# EasyEDA Pro project ProPrj_背包小智mini-c3_2025-12-10.epro

# Schematic Schematic1
Board Name: Board1; Create Date: 2025-05-15; Page Name: P1; Project Name: 复刻虾哥团队xmini c3; Schematic Name: Schematic1; Update Date: 2025-05-15; Company: 嘉立创EDA; Page Size: A4; Version: V1.0
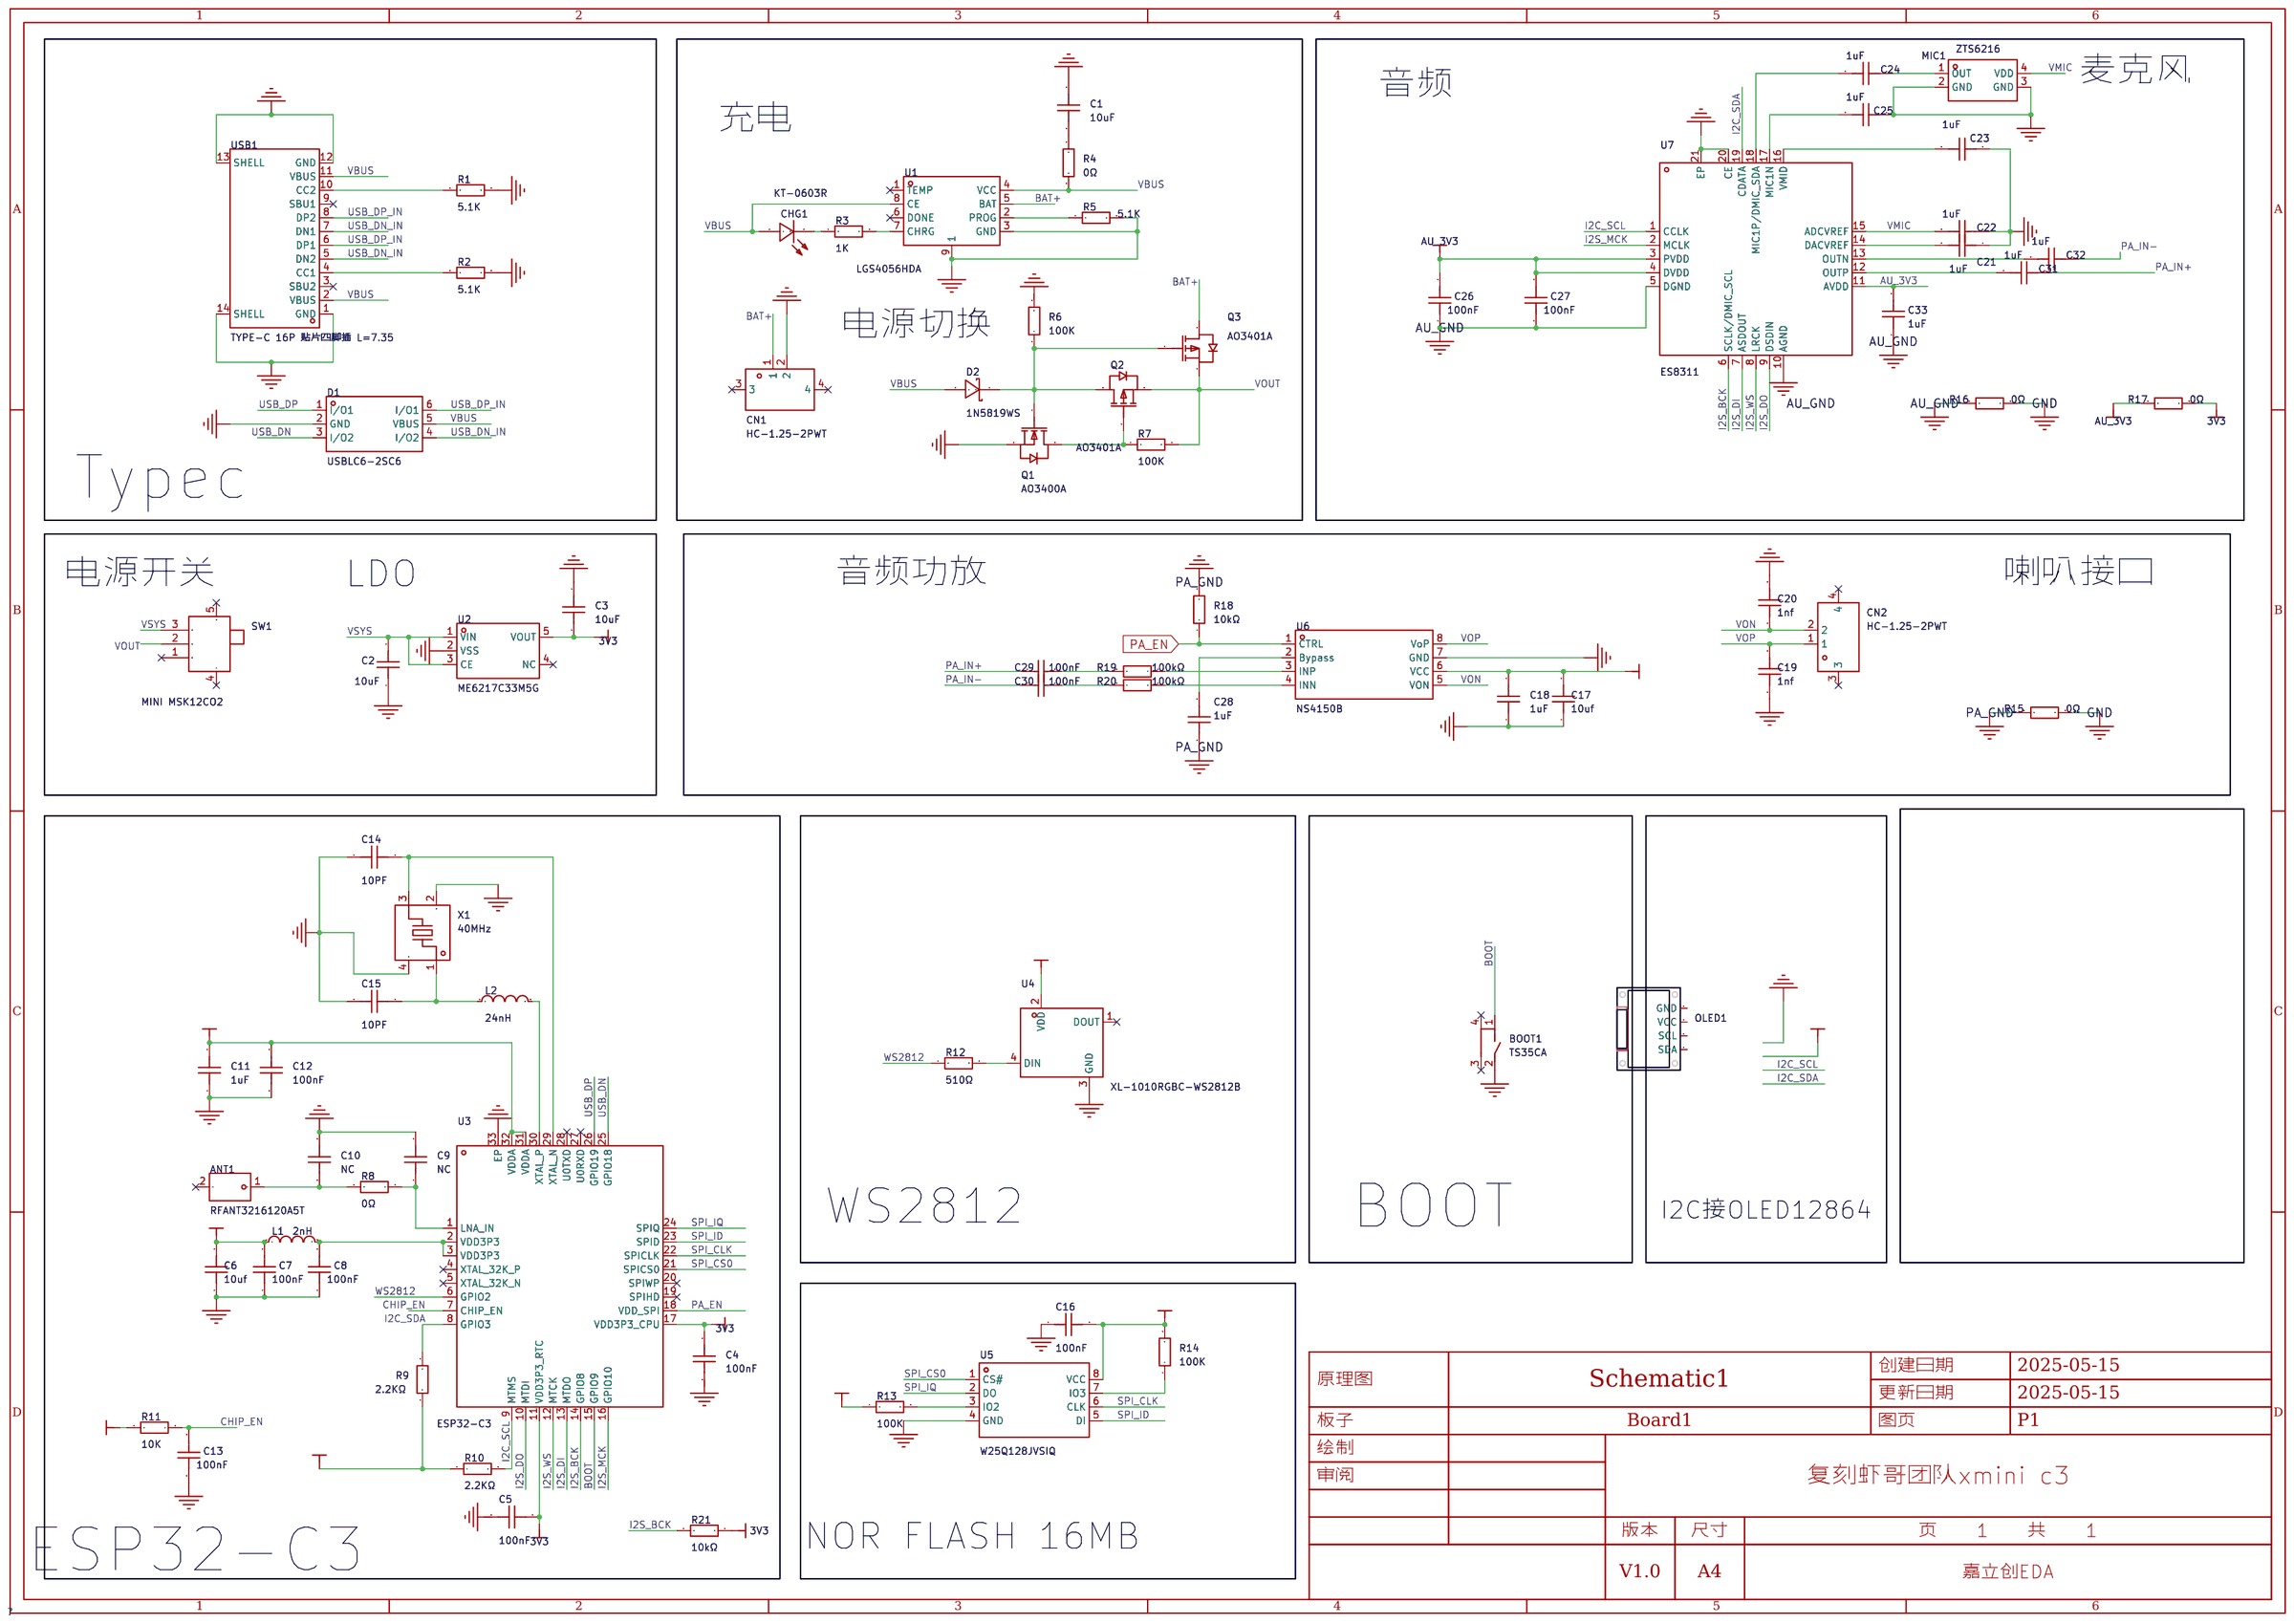
[diagram p0: schematic sheet]

## Parts
ANT1  RFANT3216120A5T  [FILTER-SMD_1206-2P-L3.2-W1.6-L]
BOOT1  TS35CA  [KEY-SMD_TS35CA]
C1  10uF  [C0402]
C2  10uF  [C0402]
C3  10uF  [C0402]
C4  100nF  [C0402]
C5  100nF  [C0402]
C6  10uf  [C0402]
C7  100nF  [C0402]
C8  100nF  [C0402]
C9  NC  [C0402]
C10  NC  [C0402]
C11  1uF  [C0402]
C12  100nF  [C0402]
C13  100nF  [C0402]
C14  10PF  [C0402]
C15  10PF  [C0402]
C16  100nF  [C0402]
C17  10uf  [C0402]
C18  1uF  [C0402]
C19  1nf  [C0402]
C20  1nf  [C0402]
C21  1uF  [C0402]
C22  1uF  [C0402]
C23  1uF  [C0402]
C24  1uF  [C0402]
C25  1uF  [C0402]
C26  100nF  [C0402]
C27  100nF  [C0402]
C28  1uF  [C0402]
C29  100nF  [C0402]
C30  100nF  [C0402]
C31  1uF  [C0402]
C32  1uF  [C0402]
C33  1uF  [C0402]
CHG1  KT-0603R  [LED0603-RD]
CN1  HC-1.25-2PWT  [CONN-SMD_2P-P1.25-HC-1.25-2PWT]
CN2  HC-1.25-2PWT  [CONN-SMD_2P-P1.25-HC-1.25-2PWT]
D1  USBLC6-2SC6  [SOT-23-6_L2.9-W1.6-P0.95-LS2.8-BL]
D2  1N5819WS  [SOD-323_L1.8-W1.3-LS2.5-RD]
L1  2nH  [L0402]
L2  24nH  [L0402]
MIC1  ZTS6216  [MIC-SMD_4P-L2.8-W1.9-P1.84-TL]
OLED1  -  [0.96OLED_4P]
Q1  AO3400A  [SOT-23-3_L2.9-W1.3-P1.90-LS2.4-BR]
Q2  AO3401A  [SOT-23_L2.9-W1.3-P1.90-LS2.4-BR]
Q3  AO3401A  [SOT-23_L2.9-W1.3-P1.90-LS2.4-BR]
R1  5.1K  [R0402]
R2  5.1K  [R0402]
R3  1K  [R0402]
R4  0Ω  [R0402]
R5  5.1K  [R0402]
R6  100K  [R0402]
R7  100K  [R0402]
R8  0Ω  [R0402]
R9  2.2KΩ  [R0402]
R10  2.2KΩ  [R0402]
R11  10K  [R0402]
R12  510Ω  [R0402]
R13  100K  [R0402]
R14  100K  [R0402]
R15  0Ω  [R0402]
R16  0Ω  [R0402]
R17  0Ω  [R0402]
R18  10kΩ  [R0402]
R19  100kΩ  [R0402]
R20  100kΩ  [R0402]
R21  10kΩ  [R0402]
SW1  MINI MSK12CO2  [SW-SMD_MSK12CO2]
U1  LGS4056HDA  [DFN-8_L2.0-W2.0-P0.50-TL-EP1.6]
U2  ME6217C33M5G  [SOT-23-5_L3.0-W1.7-P0.95-LS2.8-BR]
U3  ESP32-C3  [QFN-32_L5.0-W5.0-P0.50-TL-EP3.7]
U4  XL-1010RGBC-WS2812B  [LED-SMD_4P-L1.0-W1.0-TL_XL-1010RGBC-WS2812B]
U5  W25Q128JVSIQ  [SOIC-8_L5.3-W5.3-P1.27-LS8.0-BL]
U6  NS4150B  [MSOP-8_L3.0-W3.0-P0.65-LS5.0-BL]
U7  ES8311  [WQFN-20_L3.0-W3.0-P0.40-BL-EP1.7]
USB1  TYPE-C 16P 贴片四脚插 L=7.35  [USB-C-SMD_TYPE-C-6PIN-2MD-073]
X1  40MHz  [CRYSTAL-SMD_4P-L2.5-W2.0-BL]

## Library data of the parts
ANT1 = RFANT3216120A5T: 天线类型:芯片天线;中心频点:2.4GHz;带宽:-;峰值增益:2dBi;极化方式:-;功率容量:-;驻波比:2;; LCSC Part Name: 2.4GHz ISM频段工作频率的多层陶瓷天线; Supplier Part: C127629; Manufacturer: Walsin(华新科); Supplier Footprint: 1206; JLCPCB Part Class: 扩展库; Datasheet: https://atta.szlcsc.com/upload/public/pdf/source/20180326/C127629_E7A81F7A36316F7BB6F0FA74BB27F225.pdf; Supplier: LCSC; Antenna Type: 芯片天线; Central Frequency: 2.4GHz; Peak Gain: 2dBi; VSWR: 2; Operating Temperature: -40℃~+85℃
BOOT1 = TS35CA: 电路结构:单刀单掷;按钮形状:圆形按钮;作用力:250gf;安装方式:卧贴;开关长度:4.45mm;开关宽度:3.4mm;开关高度:3.3mm;带支架:-;触点电流:50mA;额定电压(AC):-;额定电压(DC):12V;额定功率:-;绝缘电阻:-;带灯:-;机械寿命:-;; LCSC Part Name: 4.45*3.4*3.3mm 卧贴 轻触开关; Supplier Part: C412366; Manufacturer: SHOU HAN(首韩); Supplier Footprint: SMD,3.3x4.5mm; JLCPCB Part Class: 扩展库; Datasheet: https://atta.szlcsc.com/upload/public/pdf/source/20230710/1655F8A2086A8DCFA96887FF46DC3B55.pdf; Supplier: LCSC; Circuit: 单刀单掷; Actuator Style: 圆形按钮; Operating Force: 250gf; Mounting Style: 卧贴; Switch Length: 4.45mm; Switch Width: 3.4mm; Switch Height: 3.3mm; Contact Current: 50mA; Voltage Rating (DC): 12V
C1-C27 C31 C32 = CAP_0402: Supplier Footprint: 0402
C28 C33 = CL05A105KA5NQNC: 容值:1uF;精度:±10%;额定电压:25V;材质(温度系数):X5R;; LCSC Part Name: 1uF ±10% 25V; Supplier Part: C52923; Manufacturer: SAMSUNG(三星); Supplier Footprint: 0402; Datasheet: https://atta.szlcsc.com/upload/public/pdf/source/20160103/1457707735223.pdf; Supplier: LCSC; Tolerance: ±10%; Voltage Rated: 25V; Temperature Coefficient: X5R; Check: true
C29 C30 = CL05B104KO5NNNC: 容值:100nF;精度:±10%;额定电压:16V;材质(温度系数):X7R;; LCSC Part Name: 100nF ±10% 16V; Supplier Part: C1525; Manufacturer: SAMSUNG(三星); Supplier Footprint: 0402; Datasheet: https://atta.szlcsc.com/upload/public/pdf/source/20160218/1457707763339.pdf; Supplier: LCSC; Tolerance: ±10%; Voltage Rated: 16V; Temperature Coefficient: X7R; Check: true
CHG1 = KT-0603R: 发光颜色:红色;功率:-;正向电流:-;主波长:-;二极管配置:-;透镜颜色:-;色温:-;发光角度:-;载带方式:-;工作温度:-40℃~+85℃;; LCSC Part Name: 0603 红灯 高亮; Supplier Part: C2286; Manufacturer: KENTO; Supplier Footprint: 0603; JLCPCB Part Class: 基础库; Datasheet: https://atta.szlcsc.com/upload/public/pdf/source/20160616/1466072038404.pdf; Supplier: LCSC; Emitted Color: 红色; Operating Temperature: -40℃~+85℃
CN1 CN2 = HC-1.25-2PWT: 插针结构:1x2P;间距:1.25mm;安装方式:卧贴;参考系列:PicoBlade(MX 1.25);总PIN数:2P;排数:1;每排PIN数:2;行距:-;额定电流:1A;触头材质:黄铜;触头镀层:锡;工作温度范围:-40℃~+105℃;; LCSC Part Name: 1x2P 间距:1.25mm 卧贴 系列:PicoBlade(MX 1.25); Supplier Part: C2845379; Manufacturer: HCTL(华灿天禄); Supplier Footprint: SMD,P=1.25mm,卧贴; JLCPCB Part Class: 扩展库; Datasheet: https://atta.szlcsc.com/upload/public/pdf/source/20240930/9508A8292CCC87B0C29E3A028D56E30A.pdf; Supplier: LCSC; Pins Structure: 1x2P; Pitch: 1.25mm; Mounting Style: 卧贴; Reference Series: PicoBlade(MX 1.25); Number of Pins: 2P; Number of Rows: 1; Number of PINs Per Row: 2; Current Rating (Max): 1A; Contact Material: 黄铜; Contact Plating: 锡; Operating Temperature Range: -40℃~+105℃; Rated Voltage (Max): 125V; Plastic Material: LCP; Flame Retardant Rating: UL94V-0; Supplementary Features: 辅助焊脚; Z-Height of the Board: 3.57mm; X-Length of Bottom Edge on Board (Spacing Line): 7.55mm; Y-Width of Bottom Edge on Board: 5.25mm
D1 = USBLC6-2SC6: 最大钳位电压:15V;击穿电压:6V;; Supplier Part: C2687116; Manufacturer: UMW(友台半导体); Supplier Footprint: SOT-23-6; JLCPCB Part Class: 扩展库; Datasheet: https://atta.szlcsc.com/upload/public/pdf/source/20231109/512642D850D9873E7C519F71E85B9A10.pdf; Supplier: LCSC; Maximum Clamping Voltage: 15V; Breakdown Voltage: 6V; Number of Lines: 双路; Type: ESD
D2 = 1N5819WS_C191023: 正向压降(Vf):600mV@1A;直流反向耐压(Vr):40V;整流电流:1A;; LCSC Part Name: 电压:40V 电流:1A; Supplier Part: C191023; Manufacturer: Hottech(合科泰); Supplier Footprint: SOD-323; JLCPCB Part Class: 基础库; Datasheet: https://atta.szlcsc.com/upload/public/pdf/source/20220428/3CB86FD8D28D653594B4E35F9D5AEFD9.pdf; Supplier: LCSC; Forward Voltage (Vf@If): 600mV@1A; Reverse Voltage (Vr): 40V; Rectified Current: 1A
L1 L2 = L_0402
MIC1 = ZTS6216: 方向:全指向;信噪比:65dB;灵敏度:-38dB;阻抗:100Ω;; Supplier Part: C481302; Manufacturer: ZILLTEK(钰太); Supplier Footprint: SMD-4P,1.9x2.8mm; JLCPCB Part Class: Extended Part; Datasheet: https://atta.szlcsc.com/upload/public/pdf/source/20200316/C481302_3CBECE2A7DED4DFD53CEA082844189F4.pdf; Supplier: LCSC; Direction: 全指向; Sensitivity: -38dB; SNR(Signal to Noise Ratio): 65dB; Current Consumption: 120uA; Supply Voltage: 1.5V~3.6V; Impedance: 100Ω
OLED1 = 0.96OLED模块_4P: Supplier Footprint: 插件
Q1 = AO3400A_C20917: 类型:1个N沟道;漏源电压(Vdss):30V;连续漏极电流(Id):5.7A;导通电阻(RDS(on)@Vgs,Id):26.5mΩ@10V,5.7A;功率(Pd):1.4W;阈值电压(Vgs(th)@Id):1.5V@250uA;; LCSC Part Name: 1个N沟道 耐压:30V 电流:5.7A; Supplier Part: C20917; Manufacturer: AOS; Supplier Footprint: SOT-23-3L; JLCPCB Part Class: 基础库; Datasheet: https://atta.szlcsc.com/upload/public/pdf/source/20140107/1457706668533.pdf; Supplier: LCSC; Type: 1个N沟道; Drain Source Voltage (Vdss): 30V; Continuous Drain Current (Id): 5.7A; Drain Source On Resistance (RDS(on)@Vgs,Id): 26.5mΩ@10V,5.7A; Power Dissipation (Pd): 1.4W; Gate Threshold Voltage (Vgs(th)@Id): 1.5V@250uA; Total Gate Charge (Qg@Vgs): 7nC@4.5V; Input Capacitance (Ciss@Vds): 630pF@15V; Operating Temperature: -55℃~+150℃@(Tj)
Q2 Q3 = AO3401A_C15127: 类型:1个P沟道;漏源电压(Vdss):30V;连续漏极电流(Id):4A;导通电阻(RDS(on)@Vgs,Id):44mΩ@10V,4.3A;功率(Pd):1.4W;阈值电压(Vgs(th)@Id):1.3V@250uA;; LCSC Part Name: 1个P沟道 耐压:30V 电流:4A; Supplier Part: C15127; Manufacturer: AOS; Supplier Footprint: SOT-23; JLCPCB Part Class: 基础库; Datasheet: https://atta.szlcsc.com/upload/public/pdf/source/20160507/1462613609053.pdf; Supplier: LCSC; Type: 1个P沟道; Drain Source Voltage (Vdss): 30V; Continuous Drain Current (Id): 4A; Drain Source On Resistance (RDS(on)@Vgs,Id): 44mΩ@10V,4.3A; Power Dissipation (Pd): 1.4W; Gate Threshold Voltage (Vgs(th)@Id): 1.3V@250uA; Total Gate Charge (Qg@Vgs): 12.2nC@4.5V; Input Capacitance (Ciss@Vds): 1.2nF@15V; Operating Temperature: -55℃~+150℃@(Tj)
R1-R14 = Res_0402: Supplier Footprint: 0402
R15-R17 = 0402WGF0000TCE: 电阻类型:厚膜电阻;阻值:0Ω;精度:±1%;功率:62.5mW;; LCSC Part Name: 0Ω ±1% 62.5mW; Supplier Part: C17168; Manufacturer: UNI-ROYAL(厚声); Supplier Footprint: 0402; Datasheet: https://atta.szlcsc.com/upload/public/pdf/source/20200306/C422600_1E6D84923E4A46A82E41ADD87F860B5C.pdf; Supplier: LCSC; Type: 厚膜电阻; Tolerance: ±1%; Power(Watts): 62.5mW; Temperature Coefficient: ±800ppm/℃; Overload Voltage (Max): 50V; Operating Temperature Range: -55℃~+155℃; Check: true
R18 R21 = 0402WGF1002TCE: 电阻类型:厚膜电阻;阻值:10kΩ;精度:±1%;功率:62.5mW;温度系数:±100ppm/℃;; LCSC Part Name: 厚膜电阻 10kΩ ±1% 62.5mW; Supplier Part: C25744; Manufacturer: UNI-ROYAL(厚声); Supplier Footprint: 0402; Datasheet: https://atta.szlcsc.com/upload/public/pdf/source/20200306/C422600_1E6D84923E4A46A82E41ADD87F860B5C.pdf; Supplier: LCSC; Type: 厚膜电阻; Tolerance: ±1%; Power(Watts): 62.5mW; Temperature Coefficient: ±100ppm/℃; Overload Voltage (Max): 50V; Operating Temperature Range: -55℃~+155℃; Check: true
R19 R20 = 0402WGF1003TCE: 电阻类型:厚膜电阻;阻值:100kΩ;精度:±1%;功率:62.5mW;; LCSC Part Name: 100kΩ ±1% 62.5mW; Supplier Part: C25741; Manufacturer: UNI-ROYAL(厚声); Supplier Footprint: 0402; JLCPCB Part Class: 基础库; Datasheet: https://atta.szlcsc.com/upload/public/pdf/source/20200306/C422600_1E6D84923E4A46A82E41ADD87F860B5C.pdf; Supplier: LCSC; Type: 厚膜电阻; Tolerance: ±1%; Power(Watts): 62.5mW; Temperature Coefficient: ±100ppm/℃; Overload Voltage (Max): 50V; Operating Temperature Range: -55℃~+155℃; Check: true
SW1 = MINI MSK12CO2: 电路结构:单刀双掷;安装方式:卧贴;开关颜色:-;额定电流(DC):50mA;额定电压(DC):12V;额定电流(AC):-;额定电压(AC):-;机械寿命:1万次;; LCSC Part Name: 迷你七脚两档侧拨拨动 mini七7脚 微型拨动; Supplier Part: C2681570; Manufacturer: SHOU HAN(首韩); Supplier Footprint: SMD; JLCPCB Part Class: 扩展库; Datasheet: https://atta.szlcsc.com/upload/public/pdf/source/20210224/C2681570_D263F9C605E4588A4AE6114B72AE4C72.pdf; Supplier: LCSC; Circuit: 单刀双掷; Pin Style: SMD接片; Switch Length: 5mm; Switch Width: 2.75mm; Switch Height: 1.4mm; Mounting Style: 卧贴; Current Rating (DC): 50mA; Voltage Rating (DC): 12V; Mechanical Life: 1万次; Operating Temperature: -16℃~+60℃
U1 = LGS4056HDA: 工作电压:4V~6V;最大充电电流:1A;电池类型:锂离子/聚合物;电池节数:1;; LCSC Part Name: TP4056H(DFN); Supplier Part: C5124109; Manufacturer: Legend-Si(棱晶半导体); Supplier Footprint: DFN-8(2x2); JLCPCB Part Class: 扩展库; Datasheet: https://atta.szlcsc.com/upload/public/pdf/source/20230407/EF281A5928E4D64337F5505487E44644.pdf; Supplier: LCSC; The Chip Type: 线性充电芯片; Supply Voltage: 4V~6V; Maximum Charge Current: 1A; Charging Saturation Voltage: 4.2V; Type of Battery: 锂离子/聚合物; Number of Cells: 1; Operating Temperature: -40℃~+125℃
U2 = ME6217C33M5G: 输出类型:固定;最大输入电压:7V;输出电压:3.3V;最大输出电流:800mA;电源纹波抑制比(PSRR):65dB@(1kHz);输出极性:正极;; LCSC Part Name: 输入7V 输出3.3V 800mA; Supplier Part: C427602; Manufacturer: MICRONE(南京微盟); Supplier Footprint: SOT-23-5; JLCPCB Part Class: 扩展库; Datasheet: https://atta.szlcsc.com/upload/public/pdf/source/20190910/C427602_D4B9162A2E9D9EF57C60010DFDECEF37.pdf; Supplier: LCSC; Output Type: 固定; Maximum Input Voltage: 7V; Output Voltage: 3.3V; MAX Output Current: 800mA; Power Supply Rejection Ratio (PSRR): 65dB@(1kHz); Dropout Voltage: 180mV@(300mA); Output Polarity: 正极; Number of Outputs: 1
U3 = ESP32-C3: CPU内核:RISC-V;CPU最大主频:160MHz;应用领域:-;; Supplier Part: C2838500; Manufacturer: ESPRESSIF(乐鑫); Supplier Footprint: QFN-32-EP(5x5); JLCPCB Part Class: 扩展库; Datasheet: https://atta.szlcsc.com/upload/public/pdf/source/20231220/86199E4714F7A99F6AA9401EA48CDBDA.pdf; Supplier: LCSC; CPU Core: RISC-V; CPU Maximum Speed: 160MHz; GPIO Ports Number: 22; ADC (Bit): 12bit; Low Voltage Detection Threshold: 3V~3.6V
U4 = XL-1010RGBC-WS2812B: 0404幻彩/1010幻彩 ws2812B 内置驱动IC 小尺寸幻彩; Supplier Part: C5349953; Manufacturer: XINGLIGHT(成兴光); Supplier Footprint: SMD,1x1mm; JLCPCB Part Class: 扩展库; Datasheet: https://atta.szlcsc.com/upload/public/pdf/source/20240218/17D2BD8F4295D202E0F5662BF6E5539A.pdf; Supplier: LCSC
U5 = W25Q128JVSIQ: 接口类型:SPI;存储容量:128Mbit;时钟频率(fc):133MHz;; LCSC Part Name: W25Q128JVSIQ 编带; Supplier Part: C97521; Manufacturer: WINBOND(华邦); Supplier Footprint: SOIC-8-208mil; JLCPCB Part Class: 基础库; Datasheet: https://atta.szlcsc.com/upload/public/pdf/source/20170316/1489627409956.pdf; Supplier: LCSC; Interface Type: SPI; Memory Size: 128Mbit; Clock Frequency (fc): 133MHz; Supply Voltage: 2.7V~3.6V; Page Programming Time (Tpp): 700us; Block Erase Time (tBE): 120ms@(32KB); Data Retention - TDR (Year): 20年; Operating Temperature: -40℃~+85℃
U6 = NS4150B_C189961: 功放类型:D类功放;输出功率:3Wx1@4Ω;; Supplier Part: C189961; Manufacturer: Nsiway(纳芯威); Supplier Footprint: MSOP-8; JLCPCB Part Class: 扩展库; Datasheet: https://atta.szlcsc.com/upload/public/pdf/source/20220916/DAE631F3909B9CBB38BDE76E3E6D5896.pdf; Supplier: LCSC; Type of Power Amplifier: D类功放; Output Power: 3Wx1@4Ω; Supply Voltage: 3V~5.25V
U7 = ES8311: Supplier Part: C962342; Manufacturer: Everest-semi(顺芯); Supplier Footprint: WQFN-20-EP(3x3); JLCPCB Part Class: 扩展库; Datasheet: https://atta.szlcsc.com/upload/public/pdf/source/20210630/C962342_E665EAE7274179BC7C5A390EC8AC685C.pdf; Supplier: LCSC; Check: true
USB1 = TYPE-C 16P 贴片四脚插 L=7.35: Supplier Part: C9900004817; Supplier Footprint: type-c 16PIN; JLCPCB Part Class: 扩展库; Supplier: LCSC
X1 = X252040MMB4SI: 晶振类型:贴片晶振;频率:40MHz;常温频差:±10ppm;外接负载电容:10pF;频率稳定度(全温):±20ppm;; LCSC Part Name: 40MHz ±10ppm 10pF; Supplier Part: C2885592; Manufacturer: YXC(扬兴晶振); Supplier Footprint: SMD2520-4P; JLCPCB Part Class: 扩展库; Datasheet: https://atta.szlcsc.com/upload/public/pdf/source/20240329/8B53C0AFBC5BB264DFB5D72B3757797A.pdf; Supplier: LCSC; Crystal Type: 贴片晶振; Normal temperature Frequency Tolerance: ±10ppm; External load capacitor: 10pF; Frequency Stability(Full temperature range): ±20ppm; Operating Temperature: -40℃~+85℃

## Nets
3V3: C3.2 C4.1 C5.1 C6.2 C7.2 C11.2 C12.1 C16.2 L1.1 R9.1 R10.1 R11.1 R13.1 R14.2 R17.2 R21.1 U2.5(VOUT) U3.11(VDD3P3_RTC) U3.17(VDD3P3_CPU) U3.31(VDDA) U3.32(VDDA) U5.8(VCC)
GND: BOOT1.2 C1.2 C2.1 C3.1 C4.2 C5.2 C6.1 C7.1 C8.1 C9.2 C10.2 C11.1 C12.2 C13.1 C14.1 C15.1 C16.1 CN1.2 D1.2(GND) Q1.2(S) R1.2 R2.2 R5.2 R6.2 R15.2 R16.2 U1.3(GND) U1.9(1) U2.2(VSS) U3.33(EP) U4.3(GND) U5.4(GND) USB1.1(GND) USB1.12(GND) USB1.13(SHELL) USB1.14(SHELL) X1.2(GND) X1.4(GND)
VBUS: CHG1.2(A) D1.5(VBUS) D2.2(A) R4.1 U1.4(VCC) U1.8(CE) USB1.2(VBUS) USB1.11(VBUS)
AU_3V3: C26.2 C27.2 C33.2 R17.1 U7.3(PVDD) U7.4(DVDD) U7.11(AVDD)
AU_GND: C21.1 C22.1 C23.1 C25.1 C26.1 C27.1 C33.1 MIC1.2(GND) MIC1.3(GND) R16.1 U7.5(DGND) U7.10(AGND) U7.20(CE) U7.21(EP)
BAT+: CN1.1 Q3.3(D) U1.5(BAT)
BOOT: BOOT1.1 U3.15(GPIO9)
CHIP_EN: C13.2 R11.2 U3.7(CHIP_EN)
I2C_SCL: R10.2 U3.9(MTMS) U7.1(CCLK)
I2C_SDA: R9.2 U3.8(GPIO3) U7.19(CDATA)
I2S_BCK: R21.2 U3.14(GPIO8) U7.6(SCLK/DMIC_SCL)
I2S_DI: U3.13(MTDO) U7.7(ASDOUT)
I2S_DO: U3.10(MTDI) U7.9(DSDIN)
I2S_MCK: U3.16(GPIO10) U7.2(MCLK)
I2S_WS: U3.12(MTCK) U7.8(LRCK)
PA-GND: C19.1
PA_EN: R18.1 U3.18(VDD_SPI) U6.1(CTRL)
PA_GND: C17.1 C18.1 C20.2 C28.1 R15.1 R18.2 U6.7(GND)
PA_IN+: C29.1 C31.1
PA_IN-: C30.1 C32.1
SPI_CLK: U3.22(SPICLK) U5.6(CLK)
SPI_CS0: U3.21(SPICS0) U5.1(CS#)
SPI_ID: U3.23(SPID) U5.5(DI)
SPI_IQ: U3.24(SPIQ) U5.2(DO)
USB_DN: D1.3(I/O2) U3.25(GPIO18)
USB_DN_IN: D1.4(I/O2) USB1.5(DN2) USB1.7(DN1)
USB_DP: D1.1(I/O1) U3.26(GPIO19)
USB_DP_IN: D1.6(I/O1) USB1.6(DP1) USB1.8(DP2)
VMIC: C22.2 MIC1.4(VDD) U7.15(ADCVREF)
VON: C20.1 CN2.2 U6.5(VON)
VOP: C19.2 CN2.1 U6.8(VoP)
VOUT: Q2.2(S) Q3.2(S) R7.2 SW1.2
VSYS: C2.2 C17.2 C18.2 SW1.3 U2.1(VIN) U2.3(CE) U4.2(VDD) U6.6(VCC)
WS2812: R12.1 U3.6(GPIO2)
$1N230: R1.1 USB1.10(CC2)
$1N256: R2.1 USB1.4(CC1)
$1N1694: R3.2 U1.7(CHRG)
$1N1831: C1.1 R4.2
$1N1925: CHG1.1(K) R3.1
$1N2033: R5.1 U1.2(PROG)
$1N2547: D2.1(K) Q1.1(G) Q2.3(D) Q3.1(G) R6.1
$1N2764: Q1.3(D) Q2.1(G) R7.1
$1N4486: C8.2 L1.2 U3.2(VDD3P3) U3.3(VDD3P3)
$1N4620: C9.1 R8.2 U3.1(LNA_IN)
$1N4624: ANT1.1 C10.1 R8.1
$1N6468: L2.2 U3.30(XTAL_P)
$1N6474: C15.2 L2.1 X1.1
$1N6490: C14.2 U3.29(XTAL_N) X1.3
$1N6785: R12.2 U4.4(DIN)
$1N7034: R13.2 U5.3(IO2)
$1N7137: R14.1 U5.7(IO3)
$1N8680: C21.2 U7.14(DACVREF)
$1N8771: C23.2 U7.16(VMID)
$1N8899: C24.2 U7.18(MIC1P/DMIC_SDA)
$1N8902: C24.1 MIC1.1(OUT)
$1N8930: C25.2 U7.17(MIC1N)
$1N9545: R19.1 U6.3(INP)
$1N9546: R20.1 U6.4(INN)
$1N9548: C28.2 U6.2(Bypass)
$1N9551: C29.2 R19.2
$1N9552: C30.2 R20.2
$1N11611: C31.2 U7.12(OUTP)
$1N11651: C32.2 U7.13(OUTN)

Not connected (* = marked no-connect by the designer): ANT1 2*; BOOT1 3* 4*; CN1 3* 4*; CN2 3* 4*; OLED1 1(GND) 2(VCC) 3(SCL) 4(SDA); SW1 1* 4* 5*; U1 1(TEMP)* 6(DONE)*; U2 4(NC)*; U3 4(XTAL_32K_P)* 5(XTAL_32K_N)* 19(SPIHD)* 20(SPIWP)* 27(U0RXD)* 28(U0TXD)*; U4 1(DOUT)*; USB1 3(SBU2)* 9(SBU1)*

## Notes on the sheet
- 麦克风
- 音频
- 充电
- 电源切换
- Typec
- 电源开关
- LDO
- 音频功放
- 喇叭接口
- WS2812
- BOOT
- I2C接OLED12864
- NOR FLASH 16MB
- ESP32-C3

# Board PCB1
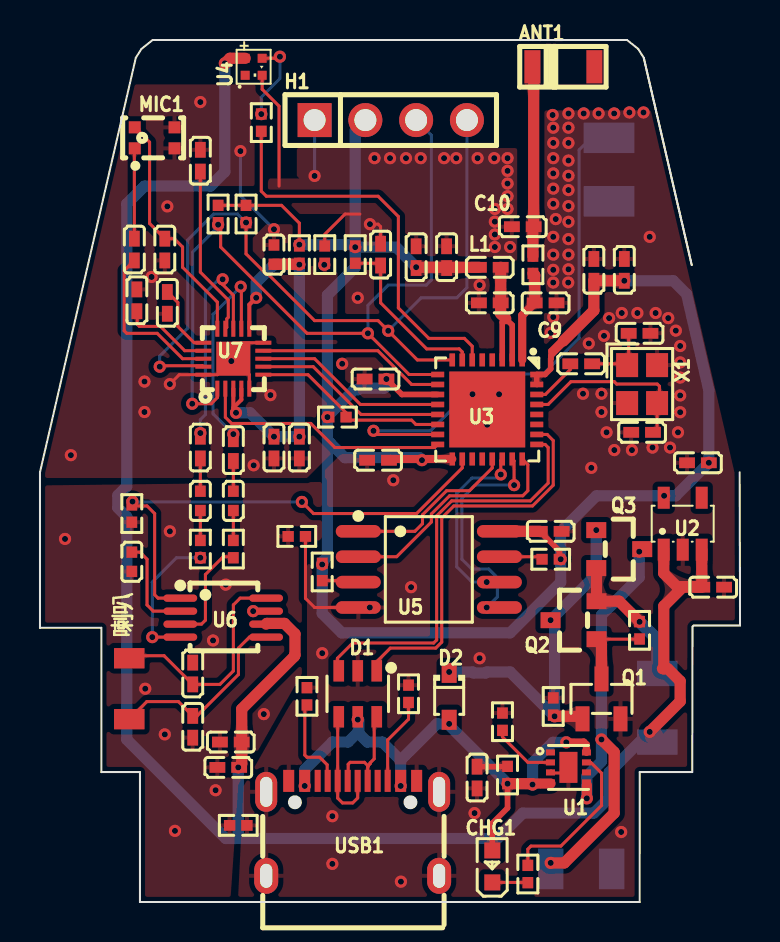
[diagram p1: board, top side]
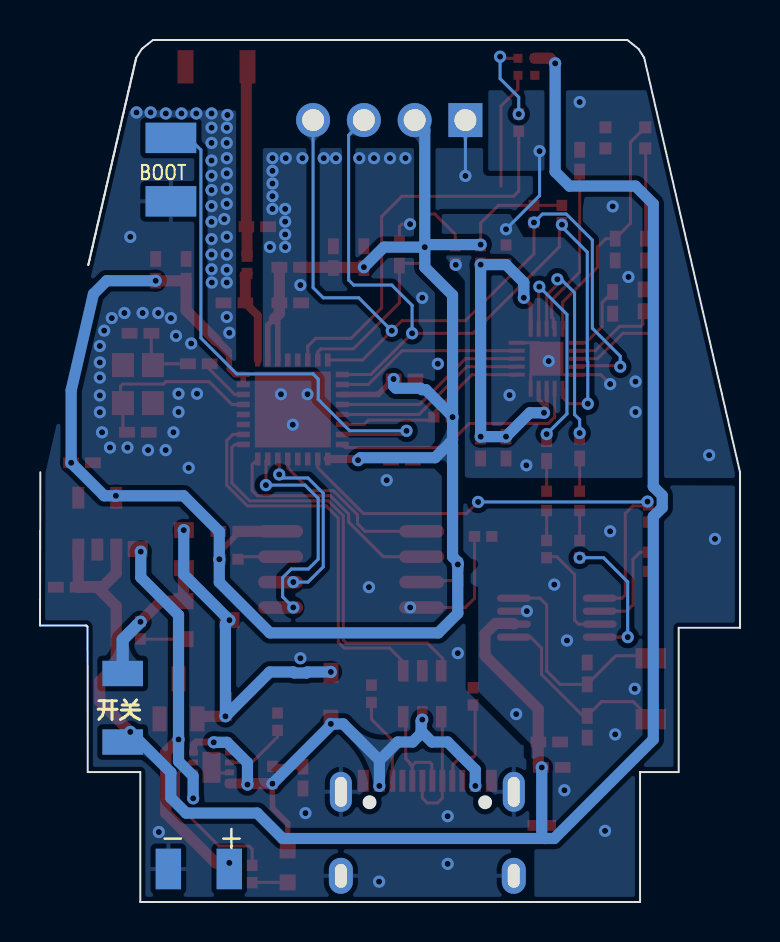
[diagram p2: board, bottom side, seen from below]

Outline 35.02 x 43.13 mm; copper layers: Top Layer, Bottom Layer. Coordinates in mm from the lower left corner of the outline.
Outline path: 30.2,42.24 29.92,42.68 29.36,43.13 5.64,43.13 5.08,42.68 4.79,42.24 0,21.5 0,13.72 3.07,13.72 3.07,6.5 5,6.5 5,0 30,0 30,6.5 32.63,6.5 32.64,13.78 32.7,13.83 35.02,13.83 35,21.5 ; 30.2,42.24 32.6,31.87 30.2,42.24
Stack: Top Layer 0.035mm / Dielectric1 1.51mm FR4 er 4.5 / Bottom Layer 0.035mm

## Design rules (mm)
spacing copperThickness1oz (default): track to track 0.102, other pairs 0 to 0.3
spacing copperThickness2oz: track to track 0.203, other pairs 0.152 to 0.3
spacing Plane_innerPlane: track to track 0.102, other pairs 0 to 0.3
spacing Copper_copperRegion: track to track 0.102, other pairs 0 to 0.3
track width copperThickness1oz (default): min 0.127, default 0.254, max 2.54
track width copperThickness2oz: min 0.203, default 0.254, max 2.54
differential pair differentialPair (default): width min 0.127, default 0.254, max 2.54; gap min 0.152, default 0.152

## Placement (name value [footprint] x y rotation side)
ANT1  RFANT3216120A5T  [FILTER-SMD_1206-2P-L3.2-W1.6-L]  26.18 41.79 0 top
C1  10uF  [C0402]  21.87 6.23 270 top
C2  10uF  [C0402]  33.68 15.75 180 top
C3  10uF  [C0402]  32.91 21.97 0 top
C4  100nF  [C0402]  16.91 22.1 180 top
C5  100nF  [C0402]  16.78 26.17 180 top
C6  10uf  [C0402]  20.34 32.26 270 top
C7  100nF  [C0402]  18.82 32.26 270 top
C8  100nF  [C0402]  22.5 29.98 0 top
C9  NC  [C0402]  25.29 29.98 0 top
C10  NC  [C0402]  24.15 33.79 180 top
C11  1uF  [C0402]  27.71 31.63 270 top
C12  100nF  [C0402]  29.23 31.63 90 top
C13  100nF  [C0402]  17.04 32.39 270 top
C14  10PF  [C0402]  30.12 23.5 0 top
C15  10PF  [C0402]  29.99 28.45 180 top
C16  100nF  [C0402]  25.55 18.55 180 top
C17  10uf  [C0402]  9.42 6.73 0 top
C18  1uF  [C0402]  9.55 8 0 top
C19  1nf  [C0402]  7.64 11.43 270 top
C20  1nf  [C0402]  7.64 8.77 270 top
C21  1uF  [C0402]  8.02 37.09 270 top
C22  1uF  [C0402]  6.24 32.64 90 top
C23  1uF  [C0402]  6.37 29.98 90 top
C24  1uF  [C0402]  4.72 32.64 270 top
C25  1uF  [C0402]  4.85 30.1 270 top
C26  100nF  [C0402]  12.97 22.74 90 top
C27  100nF  [C0402]  11.71 22.74 90 top
C28  1uF  [C0402#2]  4.59 17.02 90 top
C29  100nF  [C0402#2]  9.67 20.07 270 top
C30  100nF  [C0402#2]  8.02 20.07 270 top
C31  1uF  [C0402]  9.67 22.61 90 top
C32  1uF  [C0402]  8.02 22.74 90 top
C33  1uF  [C0402#2]  11.71 32.39 270 top
CHG1  KT-0603R  [LED0603-RD]  22.63 1.78 90 top
D1  USBLC6-2SC6  [SOT-23-6_L2.9-W1.6-P0.95-LS2.8-BL]  15.9 10.42 180 top
D2  1N5819WS  [SOD-323_L1.8-W1.3-LS2.5-RD]  20.47 10.29 270 top
H1  2.54-1*4P母  [HDR-TH_4P-P2.54-V-F]  17.55 39.12 0 top
L1  2nH  [L0402]  22.5 31.75 0 top
L2  24nH  [L0402]  27.07 26.93 180 top
MIC1  ZTS6216  [MIC-SMD_4P-L2.8-W1.9-P1.84-TL]  5.74 38.23 90 top
NOREF  -  [Pad_e172]  28.6 1.65 0 top
NOREF#2  -  [Pad_e176]  30.88 8 90 top
NOREF#3  -  [Pad_e175]  30.88 11.43 90 top
NOREF#4  -  [Pad_e171]  25.55 1.65 0 top
NOREF#5  -  [Pad_e177]  28.47 38.23 0 top
NOREF#6  -  [Pad_e173]  4.47 9.15 0 top
NOREF#7  -  [Pad_e178]  28.47 35.06 0 top
NOREF#8  -  [Pad_e174]  4.47 12.2 0 top
Q1  AO3400A  [SOT-23-3_L2.9-W1.3-P1.90-LS2.4-BR]  28.09 10.16 270 top
Q2  AO3401A  [SOT-23_L2.9-W1.3-P1.90-LS2.4-BR]  26.69 14.1 0 top
Q3  AO3401A  [SOT-23_L2.9-W1.3-P1.90-LS2.4-BR]  28.98 17.66 180 top
R1  5.1K  [R0402]  18.44 10.42 90 top
R2  5.1K  [R0402]  13.36 10.29 90 top
R3  1K  [R0402]  24.41 1.4 90 top
R4  0Ω  [R0402]  23.39 6.35 90 top
R5  5.1K  [R0402]  23.14 9.02 90 top
R6  100K  [R0402]  25.68 9.78 90 top
R7  100K  [R0402]  29.99 13.59 90 top
R8  0Ω  [R0402]  24.66 31.88 270 top
R9  2.2KΩ  [R0402]  10.31 34.42 270 top
R10  2.2KΩ  [R0402]  8.91 34.42 270 top
R11  10K  [R0402]  15.77 32.39 270 top
R12  510Ω  [R0402]  11.07 38.99 90 top
R13  100K  [R0402]  14.12 16.51 270 top
R14  100K  [R0402]  25.55 17.15 0 top
R15  0Ω  [R0402]  12.85 18.29 0 top
R16  0Ω  [R0402]  14.25 32.39 90 top
R17  0Ω  [R0402]  12.97 32.39 90 top
R18  10kΩ  [R0402]  4.59 19.43 270 top
R19  100kΩ  [R0402]  9.67 17.66 90 top
R20  100kΩ  [R0402]  8.02 17.66 90 top
R21  10kΩ  [R0402]  14.88 24.26 0 top
R200  0K  [R0402]  9.92 3.83 0 top
U1  LGS4056HDA  [DFN-8_L2.0-W2.0-P0.50-TL-EP1.6]  26.44 6.73 0 top
U2  ME6217C33M5G  [SOT-23-5_L3.0-W1.7-P0.95-LS2.8-BR]  32.15 18.93 270 top
U3  ESP32-C3  [QFN-32_L5.0-W5.0-P0.50-TL-EP3.7]  22.37 24.64 270 top
U4  XL-1010RGBC-WS2812B  [LED-SMD_4P-L1.0-W1.0-TL_XL-1010RGBC-WS2812B]  10.69 41.79 90 top
U5  W25Q128JVSIQ  [SOIC-8_L5.3-W5.3-P1.27-LS8.0-BL]  19.45 16.64 270 top
U6  NS4150B  [MSOP-8_L3.0-W3.0-P0.65-LS5.0-BL]  9.16 14.23 270 top
U7  ES8311  [WQFN-20_L3.0-W3.0-P0.40-BL-EP1.7]  9.67 27.18 0 top
USB1  TYPE-C 16P 贴片四脚插 L=7.35  [USB-C-SMD_TYPE-C-6PIN-2MD-073]  15.64 3.69 0 top
X1  40MHz  [CRYSTAL-SMD_4P-L2.5-W2.0-BL]  30.12 25.91 270 top

## Footprints (pads in the part's own frame, mm; a bottom-side part is the same pattern mirrored in y, then rotated)
C0402
  rect 0.79x0.54 smd: 1(-0.545,0) 2(0.545,0)
C0402#2
  rect 0.566x0.54 smd: 1(-0.481,0) 2(0.481,0)
CRYSTAL-SMD_4P-L2.5-W2.0-BL
  rect 1.2x1.1 smd: 1(-0.95,-0.75) 2(0.95,-0.75) 3(0.95,0.75) 4(-0.95,0.75)
DFN-8_L2.0-W2.0-P0.50-TL-EP1.6
  rect 0.45x0.3 smd: 1(-0.9,0.75) 2(-0.9,0.25) 3(-0.9,-0.25) 4(-0.9,-0.75) 5(0.9,-0.75) 6(0.9,-0.25) 7(0.9,0.25) 8(0.9,0.75)
  rect 0.9x1.55 smd: 9(-0.001,0.002)
FILTER-SMD_1206-2P-L3.2-W1.6-L
  rect 0.8x1.66 smd: 1(-1.55,0) 2(1.55,0)
HDR-TH_4P-P2.54-V-F
  rect 1.7x1.7 hole 1.1: 1(-3.81,0)
  round 1.7 hole 1.1: 2(-1.27,0) 3(1.27,0) 4(3.81,0)
L0402
  rect 0.79x0.54 smd: 1(-0.545,0) 2(0.545,0)
LED0603-RD
  rect 0.8x0.8 smd: 1(-0.799,0) 2(0.799,0)
LED-SMD_4P-L1.0-W1.0-TL_XL-1010RGBC-WS2812B
  rect 0.45x0.45 smd: 1(-0.425,0.424) 2(0.425,0.425) 3(-0.425,-0.425) 4(0.425,-0.425)
MIC-SMD_4P-L2.8-W1.9-P1.84-TL
  rect 0.6x0.6 smd: 1(-0.525,0.995) 2(-0.525,-0.995) 3(0.525,-0.995) 4(0.525,0.995)
MSOP-8_L3.0-W3.0-P0.65-LS5.0-BL
  oval 0.364x1.692 smd: 1(-0.975,-2.146) 2(-0.325,-2.146) 3(0.325,-2.146) 4(0.975,-2.146) 5(0.975,2.146) 6(0.325,2.146) 7(-0.325,2.146) 8(-0.975,2.146)
Pad_e171
  rect 1.27x2.032 smd far side: 2(0,0)
Pad_e172
  rect 1.27x2.032 smd far side: 2(0,0)
Pad_e173
  rect 1.524x1.016 smd: 1(0,0)
Pad_e174
  rect 1.524x1.016 smd: 1(0,0)
Pad_e175
  rect 1.27x2.032 smd far side: 2(0,0)
Pad_e176
  rect 1.27x2.032 smd far side: 2(0,0)
Pad_e177
  rect 2.54x1.524 smd far side: 1(0,0)
Pad_e178
  rect 2.54x1.524 smd far side: 1(0,0)
QFN-32_L5.0-W5.0-P0.50-TL-EP3.7
  rect 0.65x0.28 smd: 1(-2.478,1.75) 2(-2.478,1.25) 3(-2.478,0.75) 4(-2.478,0.25) 5(-2.478,-0.25) 6(-2.478,-0.75) 7(-2.478,-1.25) 8(-2.478,-1.75) 17(2.478,-1.75) 18(2.478,-1.25) 19(2.478,-0.75) 20(2.478,-0.25) 21(2.478,0.25) 22(2.478,0.75) 23(2.478,1.25) 24(2.478,1.75)
  rect 0.28x0.65 smd: 9(-1.75,-2.478) 10(-1.25,-2.478) 11(-0.75,-2.478) 12(-0.25,-2.478) 13(0.25,-2.478) 14(0.75,-2.478) 15(1.25,-2.478) 16(1.75,-2.478) 25(1.75,2.478) 26(1.25,2.478) 27(0.75,2.478) 28(0.25,2.478) 29(-0.25,2.478) 30(-0.75,2.478) 31(-1.25,2.478) 32(-1.75,2.478)
  rect 3.8x3.8 smd: 33(0,0)
R0402
  rect 0.566x0.54 smd: 1(-0.433,0) 2(0.433,0)
SOD-323_L1.8-W1.3-LS2.5-RD
  rect 1x0.75 smd: 1(-1.173,0) 2(1.173,0)
SOIC-8_L5.3-W5.3-P1.27-LS8.0-BL
  oval 0.63x2.25 smd: 1(-1.905,-3.53) 2(-0.635,-3.53) 3(0.635,-3.53) 4(1.905,-3.53) 5(1.905,3.53) 6(0.635,3.53) 7(-0.635,3.53) 8(-1.905,3.53)
SOT-23-3_L2.9-W1.3-P1.90-LS2.4-BR
  rect 1.25x0.7 smd: 1(1,-0.95) 2(1,0.95) 3(-1,0)
SOT-23-5_L3.0-W1.7-P0.95-LS2.8-BR
  rect 1.1x0.6 smd: 1(1.3,-0.95) 2(1.3,0) 3(1.3,0.95) 4(-1.3,0.95) 5(-1.3,-0.95)
SOT-23-6_L2.9-W1.6-P0.95-LS2.8-BL
  rect 0.532x1.072 smd: 1(-0.95,-1.149) 2(0,-1.149) 3(0.95,-1.149) 4(0.95,1.149) 5(0,1.149) 6(-0.95,1.149)
SOT-23_L2.9-W1.3-P1.90-LS2.4-BR
  rect 1x0.8 smd: 1(1.15,-0.95) 2(1.15,0.95) 3(-1.15,0)
USB-C-SMD_TYPE-C-6PIN-2MD-073
  rect 0.55x1.1 smd: 1(-3.2,2.375) 2(-2.4,2.375) 11(2.4,2.375) 12(3.2,2.375)
  rect 0.3x1.1 smd: 3(-1.75,2.375) 4(-1.25,2.375) 5(-0.75,2.375) 6(-0.25,2.375) 7(0.25,2.375) 8(0.75,2.375) 9(1.25,2.375) 10(1.75,2.375)
  oval 1.1x2 hole 0.6x1.5: 13(-4.325,1.825) 14(4.325,1.825)
  oval 1.2x1.8 hole 0.6x1.2: 13(-4.325,-2.375) 14(4.325,-2.375)
WQFN-20_L3.0-W3.0-P0.40-BL-EP1.7
  rect 0.2x0.8 smd: 1(-0.8,-1.5) 2(-0.4,-1.5) 3(0,-1.5) 4(0.4,-1.5) 5(0.8,-1.5) 11(0.8,1.5) 12(0.4,1.5) 13(0,1.5) 14(-0.4,1.5) 15(-0.8,1.5)
  rect 0.8x0.2 smd: 6(1.5,-0.8) 7(1.5,-0.4) 8(1.5,0) 9(1.5,0.4) 10(1.5,0.799) 16(-1.5,0.8) 17(-1.5,0.4) 18(-1.5,0) 19(-1.5,-0.4) 20(-1.5,-0.8)
  rect 1.7x1.7 smd: 21(0,0)

## Nets
As in the schematic, except:
3V3: C3.2 C4.1 C5.1 C6.2 C7.2 C11.2 C12.1 C16.2 H1.2 L1.1 R9.1 R10.1 R11.1 R13.1 R14.2 R17.2 R21.1 U2.5 U3.11 U3.17 U3.31 U3.32 U5.8
GND: C1.2 C2.1 C3.1 C4.2 C5.2 C6.1 C7.1 C8.1 C9.2 C10.2 C11.1 C12.2 C13.1 C14.1 C15.1 C16.1 D1.2 H1.1 NOREF.2 NOREF#7.1 Q1.2 R1.2 R2.2 R5.2 R6.2 R15.2 R16.2 R200.2 U1.3 U1.9 U2.2 U3.33 U4.3 U5.4 USB1.1 USB1.12 USB1.13 USB1.14 X1.2 X1.4
BAT+: NOREF#4.2 Q3.3 U1.5
BOOT: NOREF#5.1 U3.15
I2C_SCL: H1.3 R10.2 U3.9 U7.1
I2C_SDA: H1.4 R9.2 U3.8 U7.19
PA_GND: C17.1 C18.1 C20.2 C28.1 R15.1 R18.2 R200.1 U6.7
VON: C20.1 NOREF#6.1 U6.5
VOP: C19.2 NOREF#8.1 U6.8
VOUT: NOREF#3.2 Q2.2 Q3.2 R7.2
VSYS: C2.2 C17.2 C18.2 NOREF#2.2 U2.1 U2.3 U4.2 U6.6

Pads without a net: ANT1 2; U1 1 6; U2 4; U3 4 5 19 20 27 28; U4 1; USB1 3 9

## Via types
v1: diameter 0.61, hole 0.305, Top Layer to Bottom Layer, 170 vias

## Routing (per net, layer and track width the routed paths; a pad name or vN(x,y) marks a point on that pad's centre or on a via; arc(x,y) is an arc through that point)
3V3: length 105.2
  Top Layer w0.152: v1(12.97,32.89) 12.97,33.96 12.09,34.85 R9.1 R10.1
  Top Layer w0.28: 25.56,27.32 26.18,27.95 ; 25.56,27.32 25.56,27.58 26.06,28.07 26.18,28.07 ; 25.56,27.32 25.56,27.19 25.55,27.18 25.55,26.67 25.27,26.39 U3.32 U3.31 ; U3.11 18.1,25.39 v1(17.33,26.17) ; R14.2 25.98,17.57 C16.2
  Top Layer w0.406: U3.17 17.52,22.16 C4.1
  Top Layer w0.559: L1.1 18.85,31.75 C7.2 ; 26.18,28.07 27.71,29.59 C11.2 v1(29.23,31.08) ; U5.8 C16.2
  Bottom Layer w0.559: 16.28,39.12 15.77,38.61 v1(15.77,32.76) ; 14.51,22.98 15.25,22.23 18.99,22.23 v1(19.11,22.11) ; 14.51,22.98 14.38,22.85 14.38,17.28 14.12,17.01 v1(14.12,16.89) 14.12,14.44 15.09,13.47 23.52,13.47 26.05,16 v1(26.05,17.15) 26.05,18.54 27.83,20.32 v1(31.22,20.32) 31.81,20.32 v1(33.46,21.97) 33.46,25.6 32.34,30.42 31.68,31.08 v1(29.23,31.08) ; 14.51,22.98 14.38,23.1 v1(14.38,24.26) 14.38,24.29 ; v1(18.82,31.76) 17.82,32.76 v1(15.77,32.76) ; v1(15.77,32.76) 15.77,31.75 14.38,30.36 14.38,24.29 ; v1(15.77,32.76) 15.64,32.89 v1(12.97,32.89) ; v1(17.33,26.17) 17.33,25.82 17.21,25.7 15.99,25.7 15.91,25.63 15.72,25.63 14.38,24.29
GND: length 19.5
  Top Layer w0.152: C13.1 17.04,33.79 16.91,33.91 v1(16.51,33.91) ; R16.2 14.25,33.28 ; 11.96,35.82 11.96,39.82 11.11,40.66 U4.3 ; 26.26,6.56 26.16,6.46 25.67,6.46 25.56,6.56 ; R15.2 13.28,15.19 13.74,14.74 U5.4 ; 16,34.42 15.26,34.42 14.25,33.4
  Bottom Layer w0.152: v1(13.74,36.33) 13.74,39.12
  vias: v1(14.12,12.45) v1(14.63,4.29) v1(14.63,1.91) v1(15.12,26.93) v1(15.9,30.23) v1(16.5,14.74) v1(16.74,37.21) v1(17.51,37.21) v1(17.67,21.1) v1(18.06,1.02) v1(18.31,37.21) v1(18.56,15.75) v1(19.05,37.21) v1(20.21,37.21) v1(20.82,37.21) v1(21.64,25.4) v1(21.74,4.45) v1(21.89,37.21) v1(21.99,30.86) v1(21.99,12.2) v1(22.37,23.88) v1(22.72,37.21) v1(22.75,34.67) v1(22.75,34.04) v1(22.75,33.4) v1(22.75,32.77) v1(22.97,25.4) v1(23.39,37.21) v1(23.39,36.58) v1(23.39,35.94) v1(23.39,35.31) v1(23.39,34.67) v1(23.52,32.77) v1(25.55,28.48) v1(25.64,39.37) v1(25.68,38.74) v1(25.68,37.98) v1(25.68,37.21) v1(25.68,36.45) v1(25.68,35.69) v1(25.68,34.93) v1(25.68,33.28) v1(25.68,32.39) v1(25.68,31.63) v1(25.68,30.99) v1(25.68,29.27) v1(25.8,34.17) v1(26.44,39.45) v1(26.44,38.74) v1(26.44,37.98) v1(26.44,37.1) v1(26.44,36.33) v1(26.44,35.62) v1(26.44,34.82) v1(26.44,34.03) v1(26.44,33.17) v1(26.44,32.39) v1(26.44,31.65) v1(26.42,30.99) v1(27.2,39.45) v1(27.16,25.43) v1(27.45,27.94) v1(27.58,21.72) v1(27.94,39.45) v1(28.09,25.43) v1(28.09,24.51) v1(28.22,28.32) v1(28.34,23.5) v1(28.47,29.21) v1(28.72,39.45) v1(28.73,22.61) v1(29.1,29.47) v1(29.07,3.5) v1(29.49,39.5) v1(29.61,22.61) v1(29.88,29.47) v1(30.19,39.5) v1(30.5,33.28) v1(30.64,22.74) v1(30.8,29.47) v1(31.43,29.21) v1(31.52,22.74) v1(31.81,28.59) v1(31.92,23.5) v1(32.03,27.82) v1(32.03,27) v1(32.03,26.24) v1(32.03,25.34) v1(32.03,24.5)
VBUS: length 26.8
  Top Layer w0.28: CHG1.2 22.63,3.94 23.39,4.7 v1(23.39,5.92)
  Top Layer w0.355: v1(26.33,7.99) 26.34,8 27.2,8 27.34,7.87 U1.8
  Top Layer w0.508: v1(24.64,5.88) 24.69,5.93 25.54,5.93
  Top Layer w0.559: v1(24.64,5.88) 24.6,5.92 v1(23.39,5.92)
  Bottom Layer w0.559: v1(13.24,5.81) 13.24,6.62 14.63,8 15.41,8 15.9,8.49 ; 15.9,8.49 15.95,8.54 15.95,9.07 v1(15.9,9.13) ; 15.9,8.49 16.38,8 17.12,8 18.04,7.08 ; 18.04,7.08 v1(18.04,5.81) ; 18.04,7.08 18.04,7.1 19.85,8.91 v1(20.47,8.91) 20.47,8.84 v1(23.39,5.92) ; v1(24.64,5.88) 24.64,6.97 25.66,7.99 v1(26.33,7.99)
AU_3V3: length 20.9
  Top Layer w0.203: U7.11 10.47,29.89 v1(10.82,30.23) ; U7.4 10.07,25.13 9.67,24.73 ; v1(9.81,24.48) 9.67,24.61 9.67,24.73 ; 9.67,24.73 U7.3
  Top Layer w0.559: R17.1 12.93,31.91 C33.2
  Bottom Layer w0.559: v1(10.82,30.23) 10.82,31 11.71,31.89 v1(12.97,31.89) v1(12.97,23.28) v1(11.71,23.28) 10.51,24.48 v1(9.81,24.48)
AU_GND: length 12.2
  Top Layer w0.152: U7.21 10.47,26.38 U7.5 ; U7.21 9.97,27.47 9.97,27.85 10.09,27.98 U7.10 ; U7.21 8.87,26.38 U7.20 6.97,26.38 v1(6.5,25.91)
  Bottom Layer w0.152: v1(10.03,37.57) 10.03,35.34 v1(11.71,33.66)
  vias: v1(1.55,22.36) v1(5.23,26.04) v1(5.23,24.51) v1(5.58,31.27) v1(6.37,34.8) v1(8.02,40.02) v1(9.57,27.06) v1(10.69,21.85) v1(11.53,25.36) v1(14.22,31.88)
BAT+: length 22.2
  Top Layer w0.508: v1(27.36,5.19) 27.36,5.85
  Top Layer w0.559: v1(28.09,8.13) 28.72,7.5 28.72,4.45 26.23,1.96 v1(25.55,1.96)
  Bottom Layer w0.559: v1(27.36,5.19) 27.36,6.3 28.09,7.03 v1(28.09,8.13) 28.09,14.35 29.98,16.24 v1(29.98,17.53)
BOOT: length 26.6
  Top Layer w0.152: U3.15 16.87,23.39 v1(16.68,23.57)
  Bottom Layer w0.152: 27.77,38.24 27.58,38.24 26.97,37.63 26.97,28.22 25.17,26.42 21.36,26.42 21.1,26.17 21.1,25.15 19.53,23.57 v1(16.68,23.57)
CHIP_EN: length 8.7
  Top Layer w0.152: U3.7 21.12,27.52 20.97,27.67 19.34,27.67 17.04,29.98 C13.2 16.93,31.96 R11.2
I2C_SCL: length 39.4
  Top Layer w0.152: U3.9 18.46,26.39 v1(16.4,28.45) 13.36,28.45 9.04,32.77 9.04,33.76 v1(8.91,33.89) ; 8.87,25.68 8.87,25.24 8.56,24.93 v1(7.62,24.93)
  Bottom Layer w0.152: 18.82,39.12 19.58,38.36 19.58,31.12 19.33,30.86 17.42,30.86 16.4,29.85 v1(16.4,28.45) ; v1(8.91,33.89) 8.91,33.79 7.64,32.52 7.64,27.06 7.62,27.04 v1(7.62,24.93)
I2C_SDA: length 40.1
  Top Layer w0.152: U3.8 18.88,27.12 v1(17.42,28.58) 16.91,29.09 13.74,29.09 11.43,31.4 11.34,31.4 10.31,32.43 v1(10.31,34) ; U7.19 8.12,26.83 6.04,26.83 v1(5.99,26.78)
  Bottom Layer w0.152: v1(5.99,26.78) 5.99,27.31 7.39,28.71 7.39,33.12 8.69,34.42 9.88,34.42 v1(10.31,34) ; 21.36,39.12 21.36,30.74 20.85,30.23 19.07,30.23 v1(17.42,28.58)
I2S_BCK: length 9.9
  Top Layer w0.152: U3.14 18.81,23.89 18.59,24.11 15.47,24.11 15.31,24.26 15.31,24.48 13.41,26.38 U7.6
I2S_DI: length 9.7
  Top Layer w0.152: U3.13 16.06,24.39 13.67,26.78 U7.7
I2S_DO: length 9.4
  Top Layer w0.152: U3.10 18.59,25.89 16.9,27.58 U7.9
I2S_MCK: length 12.7
  Top Layer w0.152: U3.16 19.74,22.74 14.75,22.74 13.55,23.94 9.59,23.94 9.27,24.25 U7.2
I2S_WS: length 9.7
  Top Layer w0.152: U3.12 16.03,24.89 13.74,27.18 U7.8
PA_EN: length 24.9
  Top Layer w0.152: U3.18 21.12,21.72 18.84,19.43 13.68,19.43 v1(13.1,20.02) ; U6.1 5.9,15.2 5.74,15.37 5.74,19.43 5.36,19.82 4.65,19.82 R18.1
  Bottom Layer w0.152: v1(13.1,20.02) 4.65,20.02 v1(4.63,20.03)
PA_GND:
  vias: v1(1.25,18.16) v1(5.27,10.67) v1(6.24,8.39) v1(6.5,18.55) v1(6.75,3.56) v1(8.66,13.08) v1(8.78,5.59) v1(9.29,15.88) v1(10.66,14.55) v1(11.2,9.4)
PA_IN+: length 1.5
  Top Layer w0.152: C31.1 C29.1
PA_IN-: length 1.6
  Top Layer w0.152: C32.1 C30.1
SPI_CLK: length 8.9
  Top Layer w0.152: U3.22 23.05,22.09 v1(23.05,21.39)
  Bottom Layer w0.152: v1(22.35,16.01) 21.61,16.01 20.85,16.77 20.85,20.45 21.61,21.21 22.9,21.21 23.05,21.37 v1(23.05,21.39)
SPI_CS0: length 8.7
  Top Layer w0.152: U3.21 22.62,21.72 21.48,20.58 20.34,20.58 19.13,19.37 19.13,18.93 18.75,18.55 U5.1
SPI_ID: length 11.2
  Top Layer w0.152: v1(23.72,20.86) 23.72,22.07 U3.23
  Bottom Layer w0.152: v1(23.72,20.86) 21.76,20.86 21.1,20.2 21.1,17.15 21.59,16.66 22.45,16.66 22.88,16.23 22.88,15.27 v1(22.35,14.74)
SPI_IQ: length 11.8
  Top Layer w0.152: U5.2 17.84,17.28 19.58,19.01 19.58,19.41 20.49,20.32 24.15,20.32 24.41,20.58 24.41,21.88 U3.24
USB_DN: length 20.9
  Top Layer w0.152: U3.25 25.27,22.89 25.42,22.74 25.42,20.96 24.53,20.07 20.59,20.07 19.84,19.32 19.84,13.11 19.69,12.96 15.64,12.96 14.88,12.2 14.88,11.63 D1.3
USB_DN_IN: length 6.2
  Top Layer w0.152: USB1.7 15.89,5.21 15.64,4.96 15.13,4.96 14.89,5.2 USB1.5 14.89,9.21 D1.4
USB_DP: length 19.8
  Top Layer w0.152: D1.1 16.85,12.02 17.53,12.7 19.8,12.7 20.1,13 20.1,19.21 20.7,19.82 24.64,19.82 25.68,20.85 25.68,23.09 25.37,23.39 U3.26
USB_DP_IN: length 5.4
  Top Layer w0.152: USB1.8 16.39,6.79 ; 16.39,6.79 16.41,6.81 ; 16.39,6.79 16.43,6.79 16.41,6.81 ; USB1.6 15.39,6.43 15.42,6.46 15.42,6.89 15.52,6.99 16.23,6.99 16.41,6.81 ; 16.41,6.81 16.51,6.91 16.51,6.96 16.72,7.17 16.72,9.14 D1.6
VMIC: length 12.1
  Top Layer w0.152: 8.87,28.68 8.87,30.01 7.13,31.75 7.13,32.77 6.72,33.19 C22.2 5.48,33.95 5.48,38.01 MIC1.4
VON: length 9.9
  Top Layer w0.152: 11.31,13.25 10.48,13.25 9.93,12.7 9.93,11.38 7.86,9.31 C20.1 6.93,10.03 5.34,10.03 NOREF#6.1
VOP: length 11.5
  Top Layer w0.152: 4.09,12.32 6.21,12.32 C19.2 9,10.89 9.67,11.56 9.67,14.86 10.01,15.2 U6.8
VOUT: length 7.2
  Top Layer w0.559: Q3.2 27.84,16.69 Q2.2 28.97,15.05 R7.2
  Bottom Layer w0.61: NOREF#3.2 30.88,13.13 v1(29.99,14.02)
VSYS: length 98.6
  Top Layer w0.559: v1(9.25,41.96) 9.5,42.21 U4.2 ; v1(30.5,8.51) 32.03,10.04 32.03,11.05 31.41,11.67 31.21,11.67 ; U2.3 33.1,15.78 31.87,15.78 31.2,16.45 U2.1 ; 33.13,15.75 32.15,15.75 31.21,14.8 31.21,11.67 ; U6.6 11.35,13.94 12.23,13.94 12.76,13.41 12.76,12.36 12.72,12.32 12.72,12.29 10.09,9.66 C18.2 10.09,6.91 v1(9.92,6.73) ; 31.21,11.67 31.14,11.67
  Bottom Layer w0.559: 9.76,3.18 9.92,3.34 v1(9.92,6.73) ; 9.76,3.18 22.88,3.18 24.15,4.45 27.71,4.45 28.47,5.21 28.47,6.48 v1(30.5,8.51) ; 9.76,3.18 9.29,3.18 4.34,8.13 4.34,19.28 3.89,19.73 3.89,20.34 4.34,20.79 4.34,34.93 5.23,35.82 8.53,35.82 9.25,36.54 v1(9.25,41.96)
WS2812: length 20.1
  Top Layer w0.152: U3.6 21.62,27.8 21.23,28.2 19.45,28.2 17.93,29.72 17.93,34.29 16.91,35.31 11.32,35.31 11.07,35.56 R12.1
$1N230: length 4.4
  Top Layer w0.152: USB1.10 17.39,8.1 18.44,9.15 R1.1
$1N256: length 4.7
  Top Layer w0.152: USB1.4 14.39,6.43 14.37,6.46 14.37,6.87 13.99,7.24 13.36,7.24 13.25,7.35 13.25,9.75 R2.1
$1N1694: length 8
  Top Layer w0.152: R3.2 24.41,2.64 24.56,2.8 26.06,2.8 28.09,4.83 28.09,6.45 27.55,6.98 U1.7
$1N1831: length 1.5
  Top Layer w0.152: 23.37,6.77 R4.2
  Top Layer w0.28: C1.1 23.37,6.77
$1N1925: length 1.8
  Top Layer w0.152: R3.1 24.39,0.98 CHG1.1
$1N2033: length 3.3
  Top Layer w0.152: R5.1 23.14,8.26 24.41,6.98 U1.2
$1N2547: length 18
  Top Layer w0.559: v1(25.74,9.29) 27.01,9.29 Q1.1
  Bottom Layer w0.559: v1(27.83,18.61) 27.83,16.39 v1(25.54,14.1) 25.74,13.9 v1(25.74,9.29) 23.52,11.51 22.35,11.51 22.3,11.46 21.69,11.46 21.64,11.51 v1(20.47,11.51)
$1N2764: length 4.2
  Top Layer w0.152: R7.1 29.98,13.15 27.84,13.15
  Top Layer w0.559: Q1.3 28.09,12.9 27.84,13.15
$1N4486: length 7
  Top Layer w0.28: U3.2 23.62,28.86 23.3,29.18 23.12,29.01 U3.3
  Top Layer w0.559: 23.05,31.75 23.05,29.44 23.3,29.18
$1N4620: length 4.6
  Top Layer w0.406: C9.1 24.12,29.35 U3.1
  Top Layer w0.559: R8.2 24.75,31.36 C9.1
$1N4624: length 9.5
  Top Layer w0.559: R8.1 24.66,33.75 C10.1 24.7,41.72 24.63,41.79
$1N6468: length 2.5
  Top Layer w0.152: U3.30 25.28,25.39 26.53,26.64 L2.2
$1N6474: length 3.4
  Top Layer w0.152: C15.2 29.45,26.94 X1.1 29.3,26.93 27.62,26.93
$1N6490: length 9.1
  Top Layer w0.152: U3.29 25.42,24.89 26.56,26.03 28.73,26.03 28.85,25.91 30.88,25.91 30.99,25.8 30.99,25.08 X1.3 30.87,23.7 C14.2
$1N6785: length 4.1
  Top Layer w0.152: U4.4 11.92,42.21 v1(12,42.29)
  Bottom Layer w0.152: v1(12,42.29) 12,41.2 11.07,40.26 11.07,39.5
  vias: v1(11.07,39.42)
$1N7034: length 1.8
  Top Layer w0.152: R13.2 15.85,16.08 U5.3
$1N7137: length 2.2
  Top Layer w0.152: U5.7 24.99,17.28 R14.1
$1N8680: length 8.5
  Top Layer w0.152: U7.14 9.34,28.75 9.34,29.18 9.42,29.25 9.42,30.12 8.02,31.51 C21.2
$1N8771: length 3.6
  Top Layer w0.152: U7.16 7.71,27.98 6.9,28.79 6.9,29.99 C23.2
$1N8899: length 8.3
  Top Layer w0.152: U7.18 7.13,27.18 5.86,28.45 4.34,28.45 4.21,28.58 4.21,31.59 C24.2
$1N8902: length 4.5
  Top Layer w0.152: MIC1.1 4.72,37.68 C24.1
$1N8930: length 4.5
  Top Layer w0.152: C25.2 4.85,29.31 4.87,29.29 4.87,28.91 4.97,28.8 6.02,28.8 7.24,27.58 U7.17
$1N9545: length 5.4
  Top Layer w0.152: R19.1 9.62,17.28 9.16,17.28 8.28,16.39 8.28,14.1 8.08,13.9 U6.3
$1N9546: length 7.1
  Top Layer w0.152: 7.02,13.25 v1(5.62,13.25)
  Bottom Layer w0.152: v1(5.62,13.25) 5.62,16.01 6.83,17.22 v1(8.02,17.22)
$1N9548: length 5
  Top Layer w0.152: C28.2 5,17.5 5.36,17.15 5.36,14.86 5.66,14.55 U6.2
$1N9551: length 1.5
  Top Layer w0.152: C29.2 R19.2
$1N9552: length 1.5
  Top Layer w0.152: C30.2 R20.2
$1N11611: length 10.5
  Top Layer w0.152: v1(10.04,30.78) 10.07,30.75 U7.12
  Bottom Layer w0.152: v1(10.04,30.78) 8.66,29.4 8.66,24.42 v1(9.67,23.41)
$1N11651: length 11
  Top Layer w0.152: v1(9.14,31.15) 9.14,30.89 9.67,30.36 U7.13
  Bottom Layer w0.152: v1(8.02,23.46) 8.02,24.13 8.28,24.39 8.28,30.48 8.95,31.15 v1(9.14,31.15)

## Copper pours and planes (outline as drawn; the poured copper is in the pictures)
GND on Top Layer: 12.85,44.2 12.85,36.33 12.97,36.2 9.55,36.2 9.29,35.94 8.78,35.94 8.02,35.18 8.02,32.13 8.28,31.88 10.39,31.88 10.39,33.64 11.17,34.42 15.13,34.42 15.26,34.29 15.26,25.15 15.39,25.02 15.39,22.74 14.25,21.59 14.25,18.23 13.34,17.1 13.34,11.11 10.21,6.39 9.8,-2.03 11.2,-2.28 37.36,-2.28 37.87,-2.79 37.87,44.2 37.99,44.33 12.97,44.33
GND on Bottom Layer: 11.81,36.45 9.67,36.45 8.53,35.31 8.28,35.31 8.28,32.9 8.4,32.77 9.67,32.77 11.45,34.55 15.26,34.55 15.26,22.61 15.39,22.48 15.39,21.78 14.51,20.9 14.51,17.86 13.54,16.89 13.36,16.89 13.73,16.52 13.73,10.63 10.97,7.88 10.82,7.88 10.82,7.24 10.69,7.12 10.69,6.27 10.54,6.13 10.54,-3.04 39.01,-3.04 39.14,-2.92 39.14,44.71 36.98,46.87 12.72,46.87
AU_GND on Top Layer: 12.59,40.91 11.08,35.82 8.53,35.82 7.9,35.18 7.9,33.28 8.53,32.64 10.05,32.64 11.32,33.91 14.75,33.91 14.88,33.79 14.88,22.74 13.36,21.21 -1.25,21.21 -1.76,21.72 -1.76,38.61 3.34,40.91
AU_GND on Bottom Layer: 12.59,40.62 12.59,36.58 9.29,36.58 7.77,35.66 7.77,35.31 7.87,34.7 7.87,33.26 10.83,33.26 11.5,34.42 14.92,34.42 14.92,32.47 13.77,31.08 13.77,21.24 13.36,21.21 -0.11,21.21 -1,22.1 -1,40.62
PA_GND on Top Layer: -0.61,20.83 -0.61,2.29 3.81,-1.9 9.4,-1.9 9.92,5.85 13.1,11.43 13.1,17.13 14.1,18.23 14.1,21.02
PA_GND on Bottom Layer: -1.25,20.83 13.69,20.87 14.51,20.87 14.51,16.89 14.63,16.77 14.12,16.26 13.1,15.75 13.1,10.54 10.44,7.88 10.44,-0.5 10.05,-0.89 -1.63,-1.27 -2.14,-1.27 -2.14,19.94

Small or netless copper shapes (teardrops, artwork), in the pictures only: 167 on Top Layer, 74 on Bottom Layer

## Text on the board
Bottom Silkscreen Layer: BOOT | + | - | 开关
Top Silkscreen Layer: 喇叭
